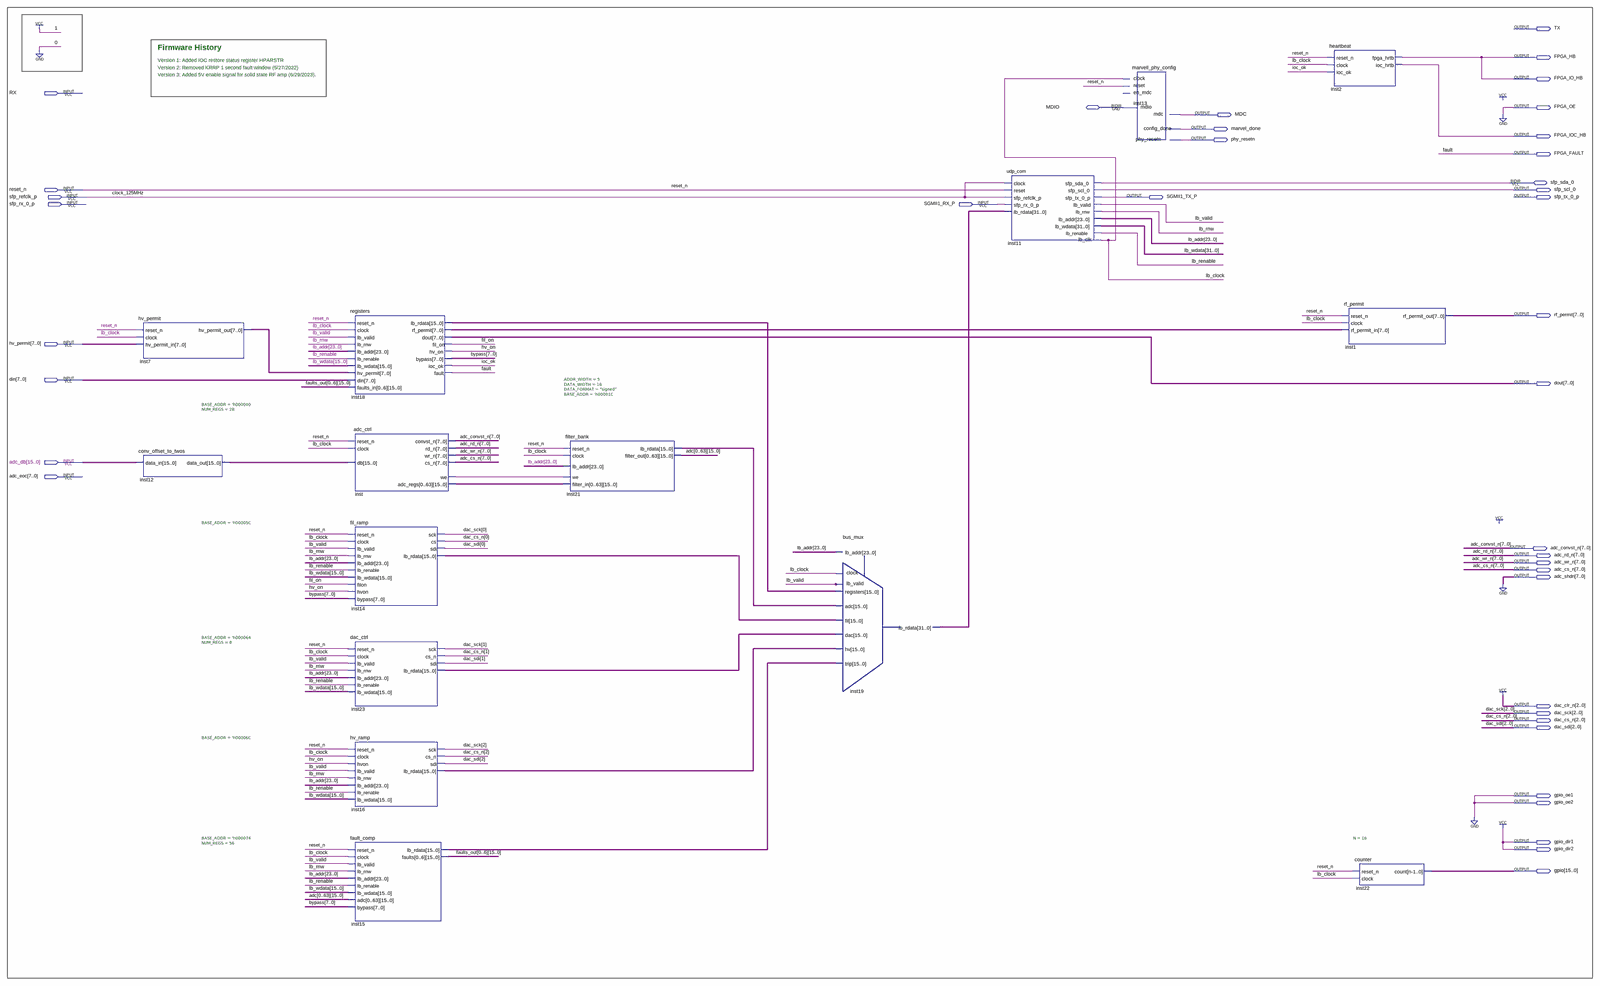
[diagram p0: schematic sheet, whole]
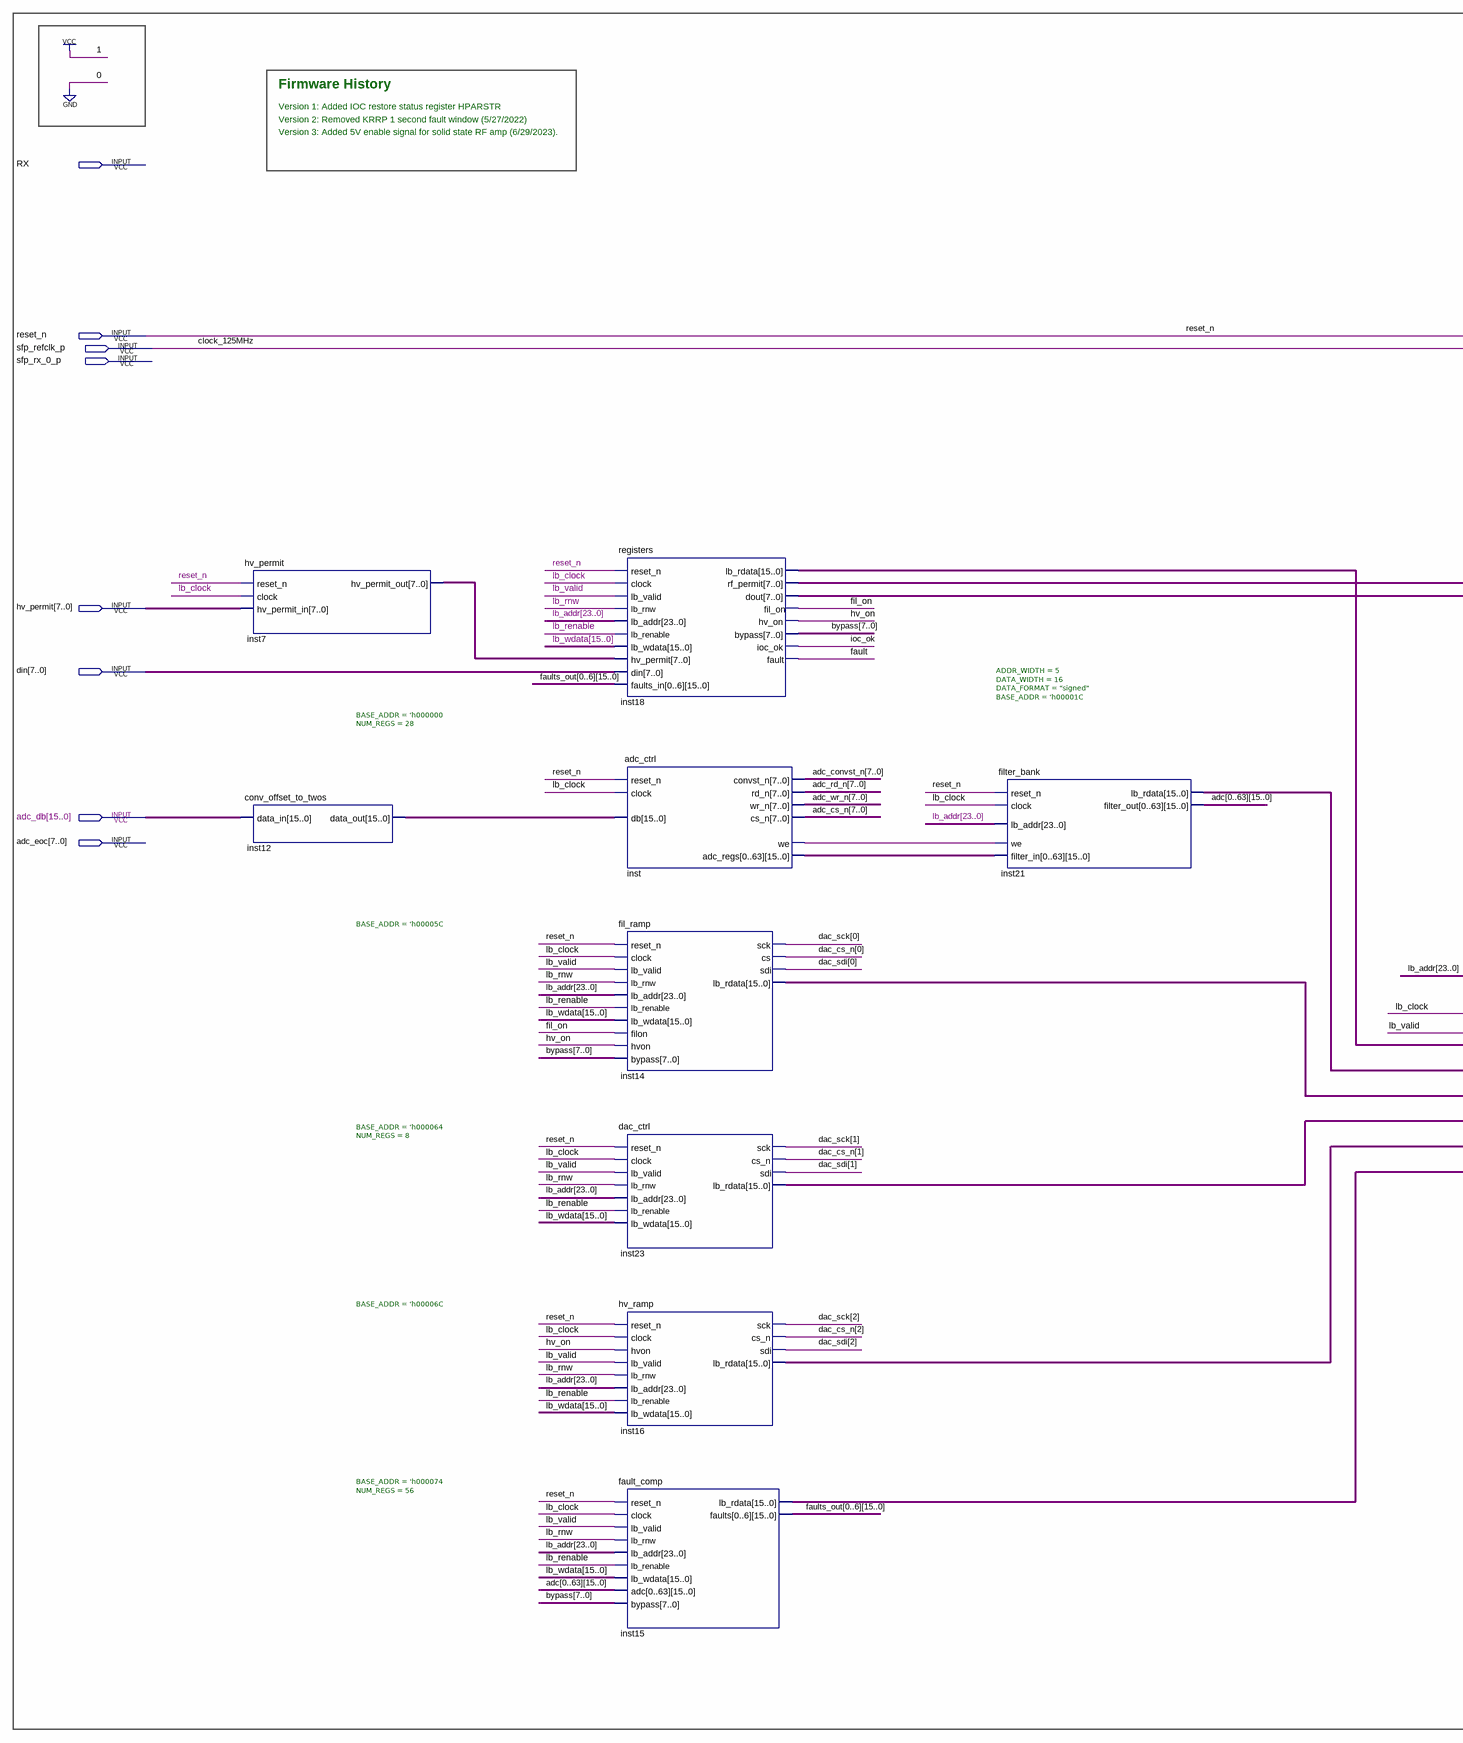
[diagram p1: schematic sheet, left part]
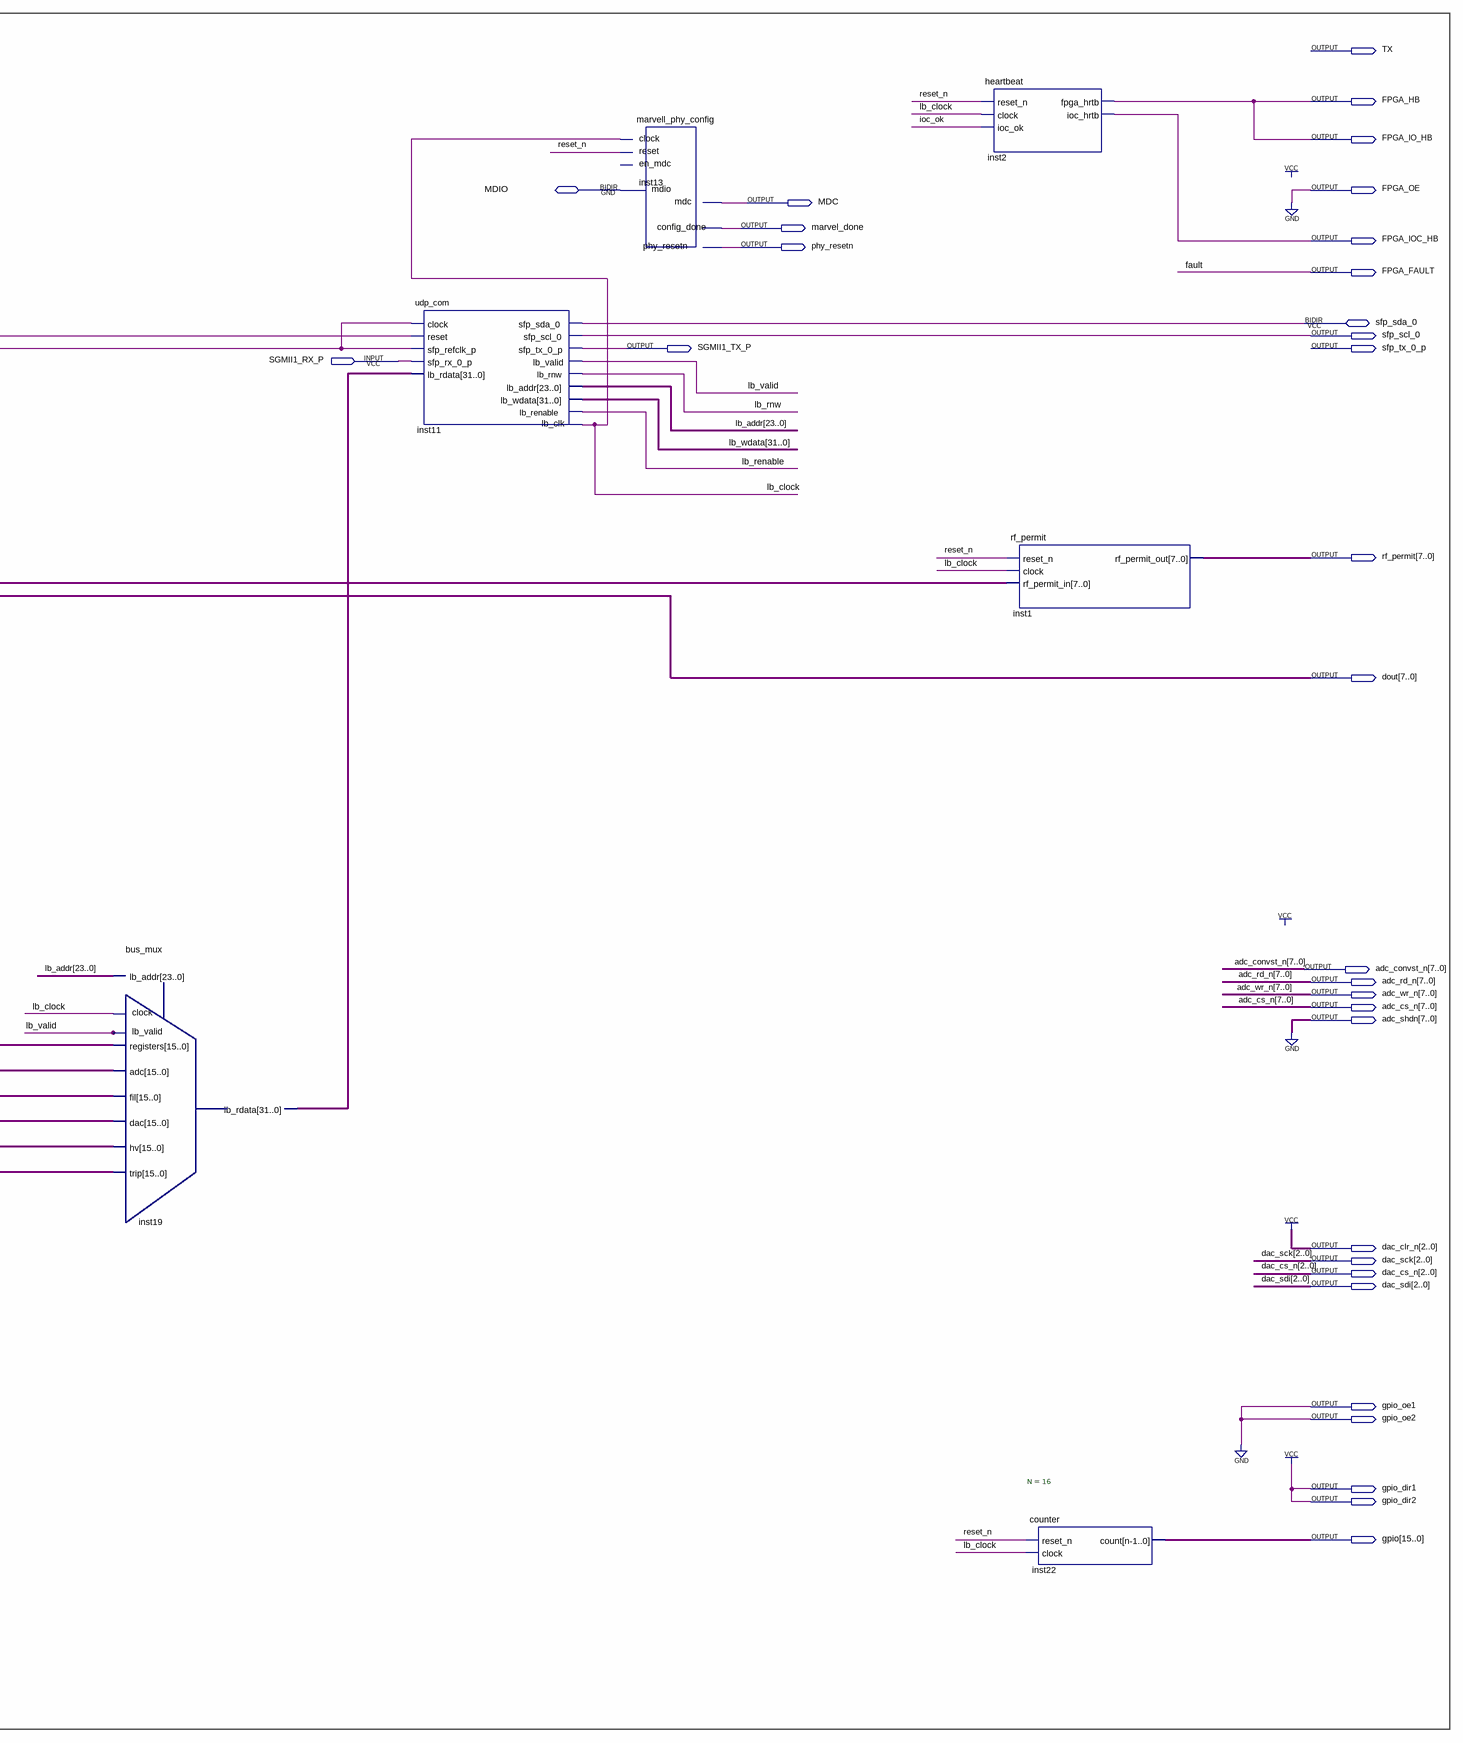
[diagram p2: schematic sheet, right part]
// Quartus schematic LLRF3_HPA_FPGA.bdf as structural Verilog: 15 symbols, 39 pins
module LLRF3_HPA_FPGA (
  input  RX,
  input  reset_n,
  input  sfp_refclk_p,
  input  sfp_rx_0_p,
  input  SGMII1_RX_P,
  input  [7:0] hv_permit,
  input  [7:0] din,
  input  [15:0] adc_db,
  input  [7:0] adc_eoc,
  inout  MDIO,
  inout  sfp_sda_0,
  output TX,
  output FPGA_HB,
  output FPGA_IO_HB,
  output FPGA_OE,
  output MDC,
  output marvel_done,
  output FPGA_IOC_HB,
  output phy_resetn,
  output FPGA_FAULT,
  output sfp_scl_0,
  output SGMII1_TX_P,
  output sfp_tx_0_p,
  output [7:0] rf_permit,
  output [7:0] dout,
  output [7:0] adc_convst_n,
  output [7:0] adc_rd_n,
  output [7:0] adc_wr_n,
  output [7:0] adc_cs_n,
  output [7:0] adc_shdn,
  output [2:0] dac_clr_n,
  output [2:0] dac_sck,
  output [2:0] dac_cs_n,
  output [2:0] dac_sdi,
  output gpio_oe1,
  output gpio_oe2,
  output gpio_dir1,
  output gpio_dir2,
  output [15:0] gpio
);

  wire fil_on, hv_on, inst_we, ioc_ok, lb_clock, lb_renable, lb_rnw, lb_valid;
  wire [7:0] bypass, inst7_hv_permit_out, inst18_rf_permit;
  wire [15:0] adc_0, adc_1, adc_2, adc_3, adc_4, adc_5, adc_6, adc_7, adc_8, adc_9, adc_10, adc_11, adc_12,
       adc_13, adc_14, adc_15, adc_16, adc_17, adc_18, adc_19, adc_20, adc_21, adc_22, adc_23, adc_24,
       adc_25, adc_26, adc_27, adc_28, adc_29, adc_30, adc_31, adc_32, adc_33, adc_34, adc_35, adc_36,
       adc_37, adc_38, adc_39, adc_40, adc_41, adc_42, adc_43, adc_44, adc_45, adc_46, adc_47, adc_48,
       adc_49, adc_50, adc_51, adc_52, adc_53, adc_54, adc_55, adc_56, adc_57, adc_58, adc_59, adc_60,
       adc_61, adc_62, adc_63, faults_out_0, faults_out_1, faults_out_2, faults_out_3, faults_out_4,
       faults_out_5, faults_out_6, inst12_data_out, inst14_lb_rdata, inst15_lb_rdata, inst16_lb_rdata,
       inst18_lb_rdata, inst21_lb_rdata, inst23_lb_rdata;
  wire [23:0] lb_addr;
  wire [31:0] inst19_lb_rdata, lb_wdata;
  wire [1023:0] inst_adc_regs;

  hv_permit inst7 (.reset_n(reset_n), .clock(lb_clock), .hv_permit_in(hv_permit), .hv_permit_out(inst7_hv_permit_out));
  conv_offset_to_twos inst12 (.data_in(adc_db), .data_out(inst12_data_out));
  registers #(.BASE_ADDR('h000000), .NUM_REGS(28)) inst18 (
    .reset_n(reset_n), .clock(lb_clock), .lb_valid(lb_valid), .lb_rnw(lb_rnw), .lb_addr(lb_addr),
    .lb_renable(lb_renable), .lb_wdata(lb_wdata[15:0]), .hv_permit(inst7_hv_permit_out), .din(din),
    .faults_in({faults_out_0, faults_out_1, faults_out_2, faults_out_3, faults_out_4, faults_out_5, faults_out_6}),
    .lb_rdata(inst18_lb_rdata), .rf_permit(inst18_rf_permit), .dout(dout), .fil_on(fil_on), .hv_on(hv_on),
    .bypass(bypass), .ioc_ok(ioc_ok), .fault(FPGA_FAULT));
  adc_ctrl inst (
    .reset_n(reset_n), .clock(lb_clock), .db(inst12_data_out), .convst_n(adc_convst_n), .rd_n(adc_rd_n),
    .wr_n(adc_wr_n), .cs_n(adc_cs_n), .we(inst_we), .adc_regs(inst_adc_regs));
  fil_ramp #(.BASE_ADDR('h00005C)) inst14 (
    .reset_n(reset_n), .clock(lb_clock), .lb_valid(lb_valid), .lb_rnw(lb_rnw), .lb_addr(lb_addr),
    .lb_renable(lb_renable), .lb_wdata(lb_wdata[15:0]), .filon(fil_on), .hvon(hv_on), .bypass(bypass),
    .sck(dac_sck[0]), .cs(dac_cs_n[0]), .sdi(dac_sdi[0]), .lb_rdata(inst14_lb_rdata));
  dac_ctrl #(.BASE_ADDR('h000064), .NUM_REGS(8)) inst23 (
    .reset_n(reset_n), .clock(lb_clock), .lb_valid(lb_valid), .lb_rnw(lb_rnw), .lb_addr(lb_addr),
    .lb_renable(lb_renable), .lb_wdata(lb_wdata[15:0]), .sck(dac_sck[1]), .cs_n(dac_cs_n[1]),
    .sdi(dac_sdi[1]), .lb_rdata(inst23_lb_rdata));
  hv_ramp #(.BASE_ADDR('h00006C)) inst16 (
    .reset_n(reset_n), .clock(lb_clock), .hvon(hv_on), .lb_valid(lb_valid), .lb_rnw(lb_rnw),
    .lb_addr(lb_addr), .lb_renable(lb_renable), .lb_wdata(lb_wdata[15:0]), .sck(dac_sck[2]),
    .cs_n(dac_cs_n[2]), .sdi(dac_sdi[2]), .lb_rdata(inst16_lb_rdata));
  fault_comp #(.BASE_ADDR('h000074), .NUM_REGS(56)) inst15 (
    .reset_n(reset_n), .clock(lb_clock), .lb_valid(lb_valid), .lb_rnw(lb_rnw), .lb_addr(lb_addr),
    .lb_renable(lb_renable), .lb_wdata(lb_wdata[15:0]),
    .adc({adc_0, adc_1, adc_2, adc_3, adc_4, adc_5, adc_6, adc_7, adc_8, adc_9, adc_10, adc_11, adc_12, adc_13, adc_14, adc_15, adc_16, adc_17, adc_18, adc_19, adc_20, adc_21, adc_22, adc_23, adc_24, adc_25, adc_26, adc_27, adc_28, adc_29, adc_30, adc_31, adc_32, adc_33, adc_34, adc_35, adc_36, adc_37, adc_38, adc_39, adc_40, adc_41, adc_42, adc_43, adc_44, adc_45, adc_46, adc_47, adc_48, adc_49, adc_50, adc_51, adc_52, adc_53, adc_54, adc_55, adc_56, adc_57, adc_58, adc_59, adc_60, adc_61, adc_62, adc_63}),
    .bypass(bypass), .lb_rdata(inst15_lb_rdata),
    .faults({faults_out_0, faults_out_1, faults_out_2, faults_out_3, faults_out_4, faults_out_5, faults_out_6}));
  filter_bank #(.ADDR_WIDTH(5), .DATA_WIDTH(16), .DATA_FORMAT("signed"), .BASE_ADDR('h00001C)) inst21 (
    .reset_n(reset_n), .clock(lb_clock), .lb_addr(lb_addr), .we(inst_we), .filter_in(inst_adc_regs),
    .lb_rdata(inst21_lb_rdata),
    .filter_out({adc_0, adc_1, adc_2, adc_3, adc_4, adc_5, adc_6, adc_7, adc_8, adc_9, adc_10, adc_11, adc_12, adc_13, adc_14, adc_15, adc_16, adc_17, adc_18, adc_19, adc_20, adc_21, adc_22, adc_23, adc_24, adc_25, adc_26, adc_27, adc_28, adc_29, adc_30, adc_31, adc_32, adc_33, adc_34, adc_35, adc_36, adc_37, adc_38, adc_39, adc_40, adc_41, adc_42, adc_43, adc_44, adc_45, adc_46, adc_47, adc_48, adc_49, adc_50, adc_51, adc_52, adc_53, adc_54, adc_55, adc_56, adc_57, adc_58, adc_59, adc_60, adc_61, adc_62, adc_63}));
  bus_mux inst19 (
    .lb_addr(lb_addr), .registers(inst18_lb_rdata), .adc(inst21_lb_rdata), .fil(inst14_lb_rdata),
    .dac(inst23_lb_rdata), .hv(inst16_lb_rdata), .trip(inst15_lb_rdata), .clock(lb_clock),
    .lb_valid(lb_valid), .lb_rdata(inst19_lb_rdata));
  udp_com inst11 (
    .clock(sfp_refclk_p), .reset(reset_n), .sfp_refclk_p(sfp_refclk_p), .sfp_rx_0_p(SGMII1_RX_P),
    .lb_rdata(inst19_lb_rdata), .sfp_scl_0(sfp_scl_0), .sfp_tx_0_p(SGMII1_TX_P), .lb_valid(lb_valid),
    .lb_rnw(lb_rnw), .lb_addr(lb_addr), .lb_wdata(lb_wdata), .lb_renable(lb_renable), .lb_clk(lb_clock),
    .sfp_sda_0(sfp_sda_0));
  marvell_phy_config inst13 (
    .clock(lb_clock), .reset(reset_n), .phy_resetn(phy_resetn), .mdc(MDC), .config_done(marvel_done),
    .mdio(MDIO));  // open: en_mdc
  heartbeat inst2 (.reset_n(reset_n), .clock(lb_clock), .ioc_ok(ioc_ok), .fpga_hrtb(FPGA_HB), .ioc_hrtb(FPGA_IOC_HB));
  rf_permit inst1 (.reset_n(reset_n), .clock(lb_clock), .rf_permit_in(inst18_rf_permit), .rf_permit_out(rf_permit));
  counter #(.N(16)) inst22 (.reset_n(reset_n), .clock(lb_clock), .count(gpio));

  assign adc_shdn = {8{1'b0}};
  assign dac_clr_n = 3'b111;
  assign FPGA_IO_HB = FPGA_HB;
  assign FPGA_OE = 1'b0;
  assign gpio_dir1 = 1'b1;
  assign gpio_dir2 = 1'b1;
  assign gpio_oe1 = 1'b0;
  assign gpio_oe2 = 1'b0;

  // Other names for the same wires on the sheet: clock_125MHz = sfp_refclk_p; fault = FPGA_FAULT

  // Notes on the sheet:
  //   Firmware History
  //   Version 1: Added IOC restore status register HPARSTR
  //   Version 2: Removed KRRP 1 second fault window (5/27/2022)
  //   Version 3: Added 5V enable signal for solid state RF amp (6/29/2023).
endmodule
